# EAGLE design nRF24L01 Shield (EAGLE 7.2.0)
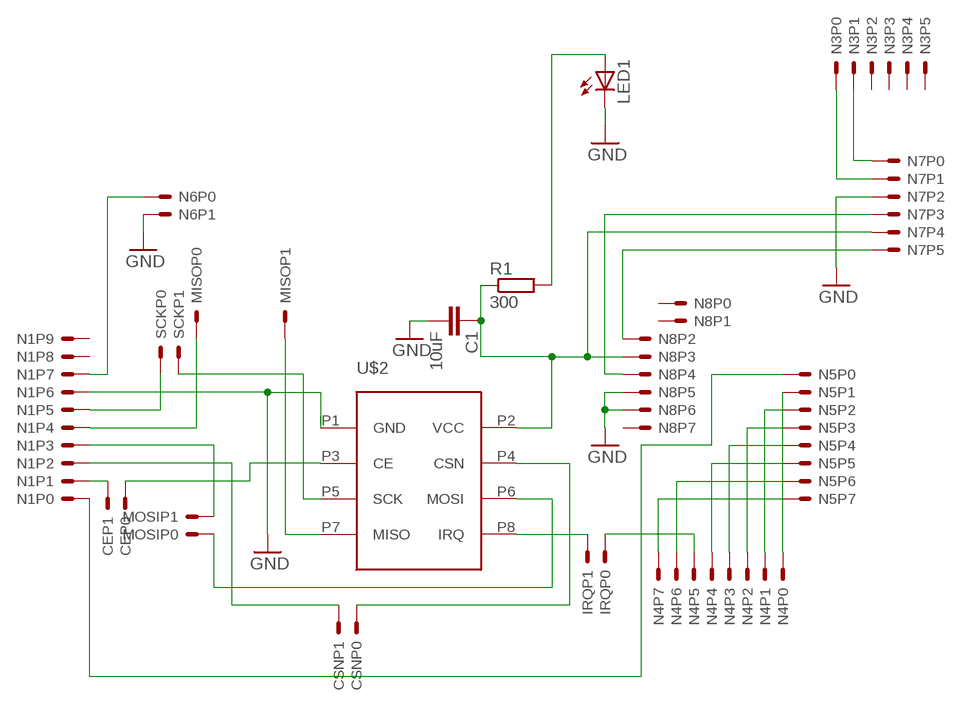
[diagram p0: schematic, sheet 1]

## Parts
C1  10uF  C2.5/4  [C2.5-4]
CE  2PINHEADER  [2PINHEADER]
CSN  2PINHEADER  [2PINHEADER]
IRQ  2PINHEADER  [2PINHEADER]
LED1  LED3MM  [LED3MM]
MISO  2PINHEADER  [2PINHEADER]
MOSI  2PINHEADER  [2PINHEADER]
N1  10PINHEADER  [10PINHEADER]
N3  6PINHEADER  [6PINHEADER]
N4  8PINHEADER  [8PINHEADER]
N5  8PINHEADER  [8PINHEADER]
N6  2PINHEADER  [2PINHEADER]
N7  6PINHEADER  [6PINHEADER]
N8  8PINHEADER  [8PINHEADER]
R1  300  R-EU_0207/10  [0207/10]
SCK  2PINHEADER  [2PINHEADER]
U$2  NRF24L01A  [NRF24L01]

## Nets
GND: C1.2 LED1.K(C) N1.P6 N6.P1 N7.P2 N8.P5 N8.P6 U$2.P1(GND)
N$1: CE.P0 U$2.P3(CE)
N$2: CSN.P0 U$2.P4(CSN)
N$3: MOSI.P0 U$2.P6(MOSI)
N$4: MISO.P1 U$2.P7(MISO)
N$5: SCK.P1 U$2.P5(SCK)
N$6: C1.1 N7.P4 N8.P3 R1.1 U$2.P2(VCC)
N$7: N1.P5 SCK.P0
N$8: IRQ.P0 N4.P5
N$9: LED1.A R1.2
N$10: MISO.P0 N1.P4
N$11: MOSI.P1 N1.P3
N$12: CSN.P1 N1.P2
N$13: CE.P1 N1.P1
N$14: IRQ.P1 U$2.P8(IRQ)
N$15: N4.P7 N5.P7
N$16: N4.P6 N5.P6
N$17: N4.P4 N5.P5
N$18: N4.P3 N5.P4
N$19: N4.P2 N5.P3
N$20: N4.P1 N5.P2
N$21: N4.P0 N5.P1
N$22: N1.P0 N5.P0
N$23: N1.P7 N6.P0
N$25: N7.P5 N8.P2
N$26: N3.P0 N7.P1
N$27: N3.P1 N7.P0
N$31: N7.P3 N8.P4
Unconnected: N1.P8 N1.P9 N3.P2 N3.P3 N3.P4 N3.P5 N8.P0 N8.P1 N8.P7

## Library data of the parts
C1 = capacitor-wima:C: CAPACITOR naming: grid - package width
CE CSN IRQ MISO MOSI N6 SCK = nRF24L01_plus:2PINHEADER
LED1 = adafruit:LED: LED OSRAM: - CHIPLED LG R971, LG N971, LY N971, LG Q971, LY Q971, LO R971, LY R971 LH N974, LH R974 LS Q976, LO Q976, LY Q976 LO Q996 - Hyper CHIPLED LW Q18S LB Q993, LB Q99A, LB R99A - SideLED LS A670, LO A670, LY A670, LG A670, LP A670 LB A673, LV A673, LT A673, LW A673 LH A674 LY A675 LS A676, LA A676, LO A676, LY A676, LW A676 LS A679, LY A679, LG A679 - Hyper Micro SIDELED® LS Y876, LA Y876, LO Y876, LY Y876 LT Y87S - SmartLED LW L88C, LW L88S LB L89C, LB L89S, LG L890 LS L89K, LO L89K, LY L89K LS L896, LA L896, LO L896, LY L896 - TOPLED LS T670, LO T670, LY T670, LG T670, LP T670 LSG T670, LSP T670, LSY T670, LOP T670, LYG T670 LG T671, LOG T671, LSG T671 LB T673, LV T673, LT T673, LW T673 LH T674 LS T676, LA T676, LO T676, LY T676, LB T676, LH T676, LSB T676, LW T676 LB T67C, LV T67C, LT T67C, LS T67K, LO T67K, LY T67K, LW E67C LS E67B, LA E67B, LO E67B, LY E67B, LB E67C, LV E67C, LT E67C LW T67C LS T679, LY T679, LG T679 LS T770, LO T770, LY T770, LG T770, LP T770 LB T773, LV T773, LT T773, LW T773 LH T774 LS E675, LA E675, LY E675, LS T675 LS T776, LA T776, LO T776, LY T776, LB T776 LHGB T686 LT T68C, LB T68C - Hyper Mini TOPLED® LB M676 - Mini TOPLED Santana® LG M470 LS M47K, LO M47K, LY M47K Source: http://www.osram.convergy.de/
N1 = nRF24L01_plus:10PINHEADER
N3 N7 = nRF24L01_plus:6PINHEADER
N4 N5 = nRF24L01_plus:8PINHEADER
N8 = ForceTronics:8PINHEADER
R1 = resistor:R-EU_: RESISTOR, European symbol
U$2 = ForceTronics:NRF24L01

## Board
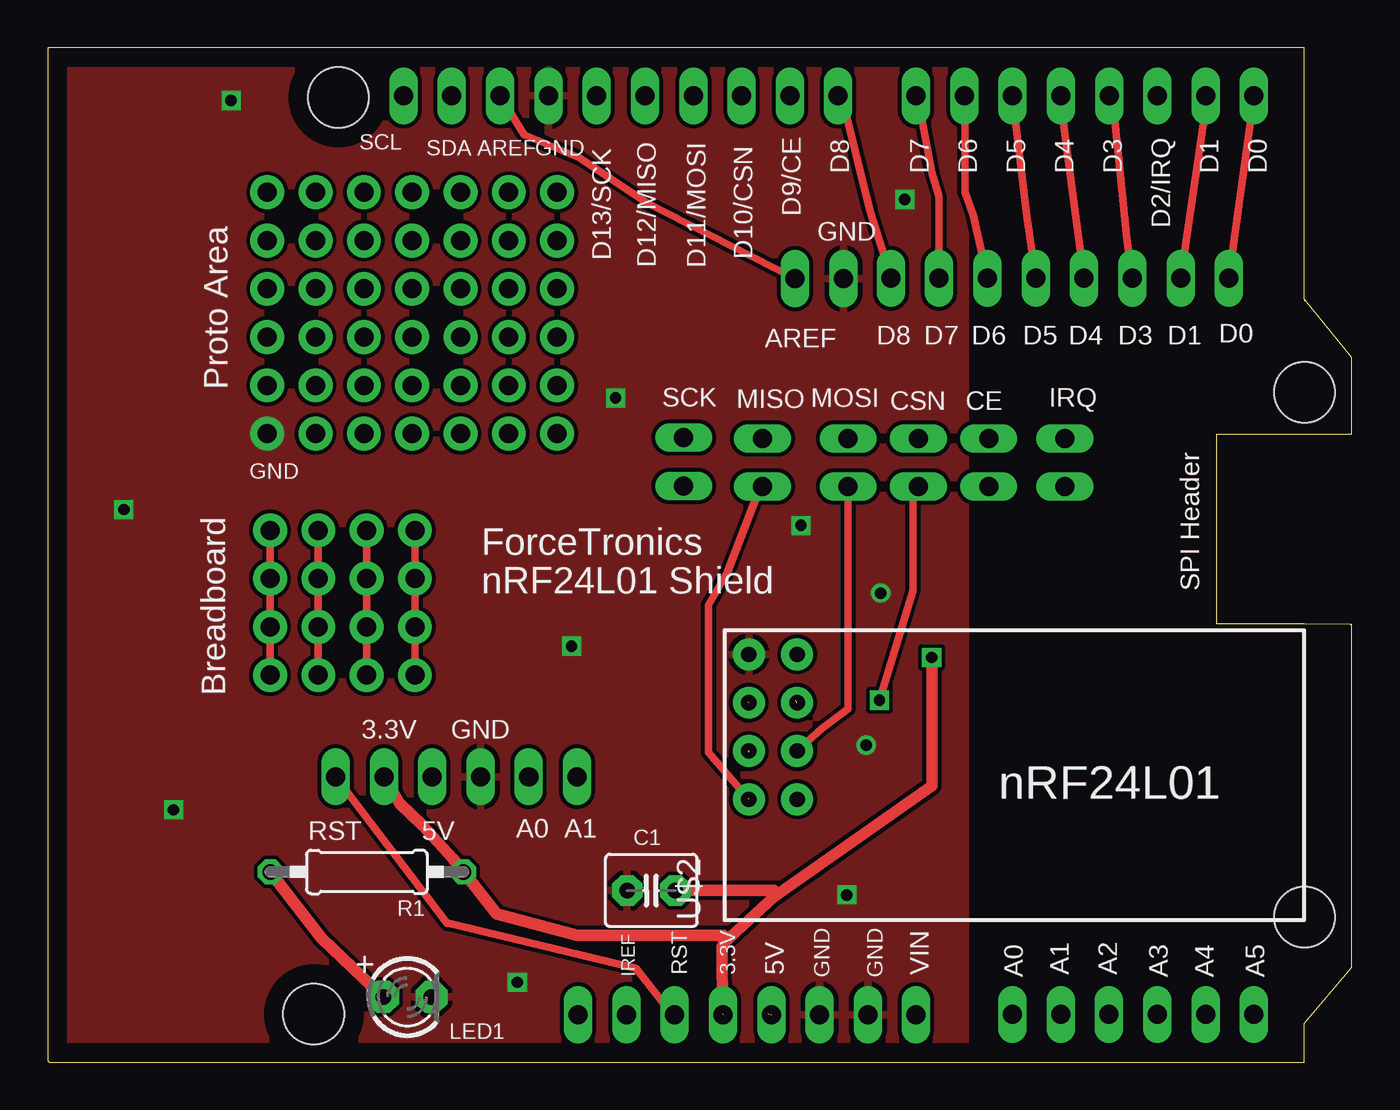
[diagram p1: board, top side]
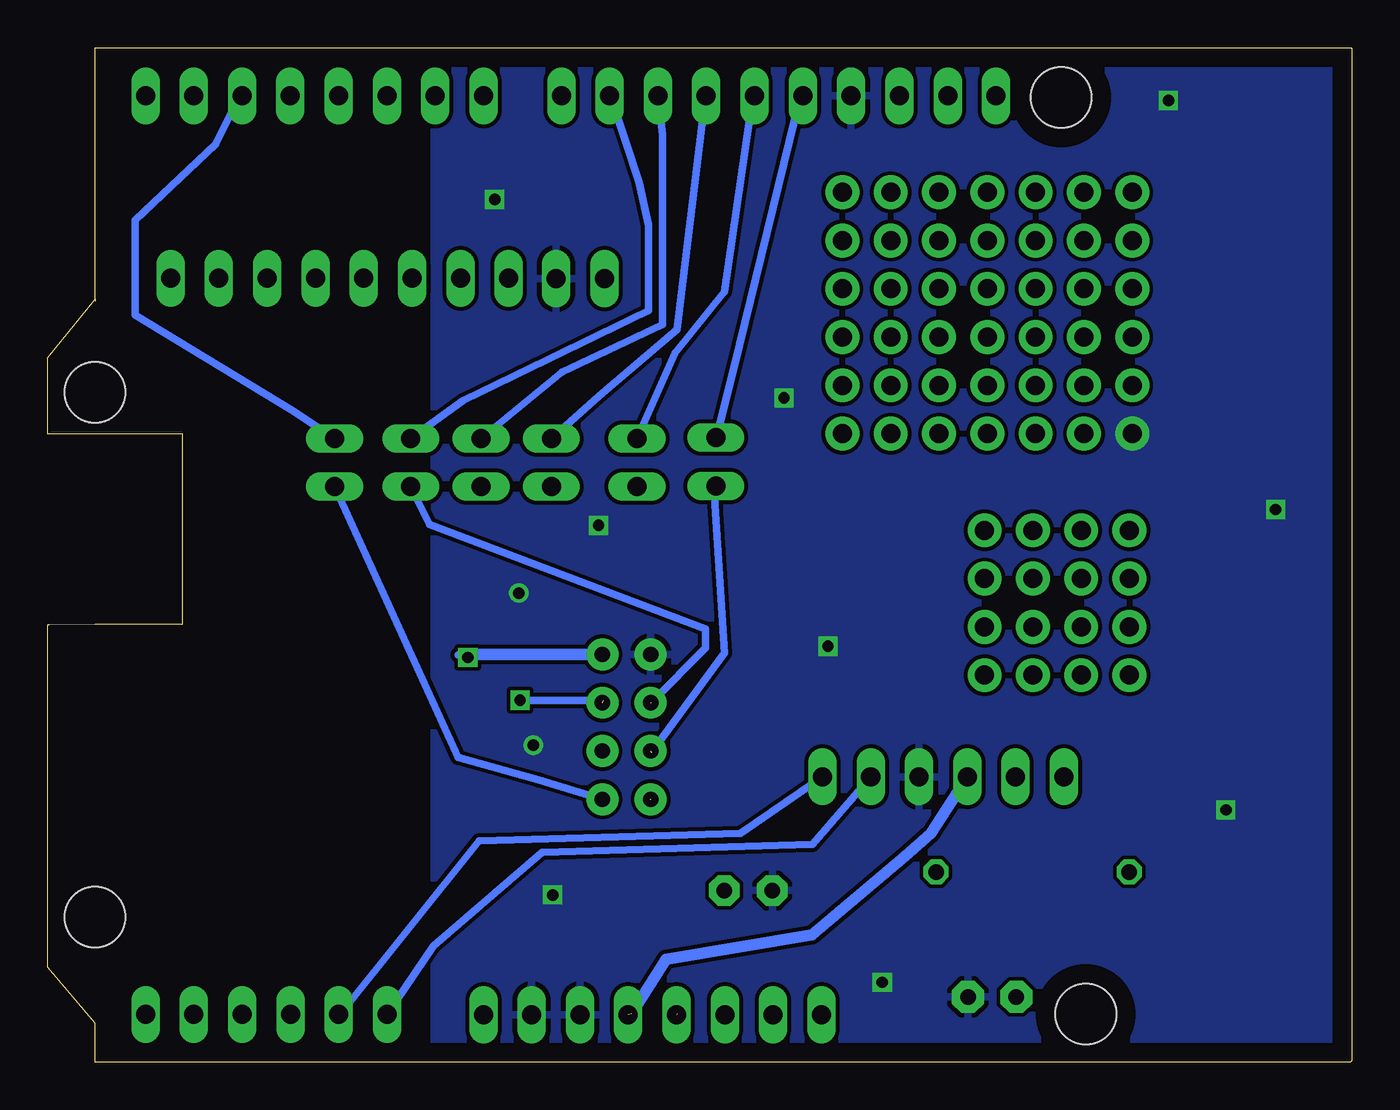
[diagram p2: board, bottom side, seen from below]

Size 68.6 x 53.38 mm. Coordinates in mm from the lower left corner, seen from the top.
Outline: 66.1,40.15 68.6,37.08 68.6,33.1 arc-90 68.55,33.05 61.5,33.05 61.5,23.05 66.1,23.05 68.5,23.05 arc-90 68.6,22.95 68.6,5 66.1,2.05 66.1,0 0.16,0 arc-90 0,0.16 0,53.28 arc-90 0.1,53.38 66.1,53.38 66.1,40.15
Outline: 66.1,40.15 66.1,40.05
Copper layers (1*16): Top 0.035mm / dielectric 1.5mm / Bottom 0.035mm
Design rules "default": minimum track width 10mil, minimum drill 24mil, track to track 8mil, track to pad 8mil, pad to pad 8mil, via to via 8mil, smd to smd 8mil, copper to edge 40mil, drill to drill 8mil, minimum pad ring 10mil, minimum via ring 8mil, stop-mask expansion 4mil, vias tented up to drill 0mil, thermal gap 10mil
Holes 3.2 mm at 14,2.55 15.3,50.75 66.1,7.65 66.11,35.24

### Footprints (pad centres in the part's own frame; a part is rotated, then mirrored left to right if it is on the bottom)
C2.5-4 = drill 0.813 pad 1.6 octagon: 1 -1.27,0; 2 1.27,0
2PINHEADER = drill 1 long: P0 -1.27,0; P1 1.27,0
LED3MM = drill 0.813 pad 1.676 octagon: A -1.27,0; K 1.27,0
10PINHEADER = drill 1 long: P0 1.27,-3.81; P1 3.81,-3.81; P2 6.35,-3.81; P3 8.89,-3.81; P4 11.43,-3.81; P5 13.97,-3.81; P6 16.51,-3.81; P7 19.05,-3.81; P8 21.59,-3.81; P9 24.13,-3.81
6PINHEADER = drill 1 long: P0 1.27,-1.778; P1 3.81,-1.778; P2 6.35,-1.778; P3 8.89,-1.778; P4 11.43,-1.778; P5 13.97,-1.778
8PINHEADER = drill 1 long: P0 1.27,-3.81; P1 3.81,-3.81; P2 6.35,-3.81; P3 8.89,-3.81; P4 11.43,-3.81; P5 13.97,-3.81; P6 16.51,-3.81; P7 19.05,-3.81
0207/10 = drill 0.813 octagon: 1 -5.08,0; 2 5.08,0
NRF24L01 = drill 0.8 pad 1.676: P1 13.97,-1.27; P2 13.97,-3.81; P3 11.43,-1.27; P4 11.43,-3.81; P5 8.89,-1.27; P6 8.89,-3.81; P7 6.35,-1.27; P8 6.35,-3.81

### Placement (x,y rotation side)
C1  31.75,9.05 180 top
CE  49.5,31.55 90 top
CSN  45.8,31.55 90 top
IRQ  53.5,31.55 270 top
LED1  18.92,3.45 0 top
MISO  37.6,31.55 270 top
MOSI  42.1,31.55 90 top
N1  42.85,47.02 180 top
N3  49.48,4.3 0 top
N4  44.4,54.65 0 top
N5  43.08,45.05 0 top
N6  40.58,41.23 0 top
N7  29.12,13.25 180 top
N8  26.63,6.32 0 top
R1  16.8,10.02 180 top
SCK  33.45,31.59 270 top
U$2  35.61,7.49 90 top

### Tracks (layer width: path | path; a pad name or v marks a point on that pad's centre or on a via)
GND  (via drill 0.6, 0.6 pad 0.81, 1 pad 1.78)
  other vias: 6.63,13.28 24.71,4.22 42.04,8.81 43.81,24.69 43.05,16.69 27.56,21.89 39.62,28.24 29.87,34.95 45.09,45.39 9.65,50.6 11.56,33.07 4.01,29.08
  pour Top: -2.54,55.93 -2.54,-2.49 48.26,-2.49 48.26,55.93
  pour Bottom: -2.54,55.93 48.26,55.93 48.26,-2.49 -2.54,-2.49
N$1  (1 unrouted)
  Bottom 0.406: CE.P0 48.5,28.3 34,22.8 34,21.8 36.83,18.95
N$2  (via drill 0.6)  (1 unrouted)
  Top 0.406: CSN.P0 45.5,30.28 45.5,24.8 v43.75,19.05
  Bottom 0.406: v43.75,19.05 39.37,19.05
N$3
  Top 0.406: MOSI.P0 42.1,18.59 40.72,17.58 U$2.P6
N$4  (1 unrouted)
  Top 0.406: MISO.P1 37.5,30.28 35.75,25.8 34.75,24.05 34.75,16.3 36.85,13.85
N$5  (1 unrouted)
  Bottom 0.406: SCK.P1 33.5,29.32 33,21.55 36.83,16.3
N$6  (via drill 0.6)  (1 unrouted)
  Top 0.406: 35.48,6.09 35.55,6.27 | 38.21,9.05 38.21,8.71
  Top 0.61: 35.5,2.55 35.48,6.09 | v46.5,21.3 46.5,14.55 38.21,8.71 35.55,6.27 35.55,6.68 27.84,6.68 23.62,7.82 R1.1 21.32,10.71 19.73,12.47 18.52,13.63 N7.P4 | C1.1 38.21,9.05
  Bottom 0.406: 47,21.42 v46.5,21.3 46.5,21.46
  Bottom 0.61: U$2.P2 46.5,21.46
N$7
  Bottom 0.406: 33.25,32.86 SCK.P0 33.45,32.8 32.5,36.55 29,50.83 N1.P5
N$8
  Bottom 0.406: N4.P5 58.5,50.84 59.75,48.3 64,44.3 64,39.3 55.75,34.3 IRQ.P0
N$9
  Top 0.61: LED1.A 14.41,6.52 R1.2
N$10
  Bottom 0.406: N1.P4 31.5,50.83 33,40.55 35.6,37.3 MISO.P0
N$11
  Bottom 0.406: N1.P3 34,50.83 35.5,38.55 39.6,35.05 MOSI.P1
N$12
  Bottom 0.406: N1.P2 36.25,48.8 36.25,38.8 41.55,36.3 CSN.P1
N$13
  Bottom 0.406: N1.P1 39,50.83 37.5,46.3 37,44.05 37,39.55 46.75,34.8 CE.P1
N$14
  Bottom 0.406: IRQ.P1 47,16.05 42.78,14.86 U$2.P8
N$15
  Top 0.406: N5.P7 63.45,50.74 N4.P7
N$16
  Top 0.406: N4.P6 61,50.84 61,50.8 59.59,41.3 N5.P6
N$17
  Top 0.406: N4.P4 56,50.84 56.75,43.3 57.05,41.3 N5.P5
N$18
  Top 0.406: N4.P3 53.25,50.84 54,45.05 54.51,41.3 N5.P4
N$19
  Top 0.406: N5.P3 51.5,44.49 N4.P2
N$20
  Top 0.406: N4.P1 48.25,50.84 48.25,45.8 48.68,44.55 N5.P2
N$21
  Top 0.406: N4.P0 45.75,50.84 46.5,46.8 46.89,45.55 N5.P1
N$22
  Top 0.406: N1.P0 41.75,50.83 43.25,44.8 44.35,41.3 N5.P0
N$23
  Top 0.406: 23.7,50.83 N1.P7 25.05,48.8 28,47.55 31.5,45.23 N6.P0
N$25
  Top 0.406: N7.P5 21.01,7.33 21.01,7.34 30.94,4.95 32.87,2.51 N8.P2
N$26
  Bottom 0.406: N3.P0 48.3,6.12 42.6,11.05 28.37,11.48 N7.P1
N$27
  Bottom 0.406: N3.P1 53.2,2.52 45.9,11.65 32.15,12.05 N7.P0
N$28  (via drill 1 pad 1.78)
  other vias: 11.56,45.77
N$29  (via drill 1 pad 1.78)
  other vias: 14.1,45.77
N$30  (via drill 1 pad 1.78)
  other vias: 16.64,45.77
N$31  (1 unrouted)
  Bottom 0.61: 37.9,2.55 36.07,5.43 28.4,6.72 23.5,10.85 22.13,12.05 N7.P3
N$32  (via drill 1 pad 1.78)
  other vias: 19.18,45.77
N$33  (via drill 1 pad 1.78)
  other vias: 21.72,45.77
N$34  (via drill 1 pad 1.78)
  other vias: 24.26,45.77
N$35  (via drill 1 pad 1.78)
  other vias: 26.8,45.77
N$36  (via drill 1 pad 1.78)
  other vias: 11.56,43.23
N$37  (via drill 1 pad 1.78)
  other vias: 14.1,43.23
N$38  (via drill 1 pad 1.78)
  other vias: 16.64,43.23
N$39  (via drill 1 pad 1.78)
  other vias: 19.18,43.23
N$40  (via drill 1 pad 1.78)
  other vias: 21.72,43.23
N$41  (via drill 1 pad 1.78)
  other vias: 24.26,43.23
N$42  (via drill 1 pad 1.78)
  other vias: 26.8,43.23
N$43  (via drill 1 pad 1.78)
  other vias: 11.56,40.69
N$45  (via drill 1 pad 1.78)
  other vias: 14.1,40.69
N$46  (via drill 1 pad 1.78)
  other vias: 16.64,40.69
N$47  (via drill 1 pad 1.78)
  other vias: 19.18,40.69
N$48  (via drill 1 pad 1.78)
  other vias: 21.72,40.69
N$49  (via drill 1 pad 1.78)
  other vias: 24.26,40.69
N$50  (via drill 1 pad 1.78)
  other vias: 26.8,40.69
N$51  (via drill 1 pad 1.78)
  other vias: 26.8,38.15
N$52  (via drill 1 pad 1.78)
  other vias: 24.26,38.15
N$53  (via drill 1 pad 1.78)
  other vias: 21.72,38.15
N$54  (via drill 1 pad 1.78)
  other vias: 19.18,38.15
N$55  (via drill 1 pad 1.78)
  other vias: 16.64,38.15
N$56  (via drill 1 pad 1.78)
  other vias: 14.1,38.15
N$57  (via drill 1 pad 1.78)
  other vias: 11.56,38.15
N$58  (via drill 1 pad 1.78)
  other vias: 11.56,35.61
N$59  (via drill 1 pad 1.78)
  other vias: 14.1,35.61
N$60  (via drill 1 pad 1.78)
  other vias: 16.64,35.61
N$61  (via drill 1 pad 1.78)
  other vias: 19.18,35.61
N$62  (via drill 1 pad 1.78)
  other vias: 21.72,35.61
N$63  (via drill 1 pad 1.78)
  other vias: 24.26,35.61
N$64  (via drill 1 pad 1.78)
  other vias: 26.8,35.61
N$65  (via drill 1 pad 1.78)
  other vias: 26.8,33.07
N$66  (via drill 1 pad 1.78)
  other vias: 24.26,33.07
N$67  (via drill 1 pad 1.78)
  other vias: 21.72,33.07
N$68  (via drill 1 pad 1.78)
  other vias: 19.18,33.07
N$69  (via drill 1 pad 1.78)
  other vias: 16.64,33.07
N$70  (via drill 1 pad 1.78)
  other vias: 14.1,33.07
N$74  (via drill 1 pad 1.78)
  Top 0.406: v11.7,27.99 v11.7,25.45 v11.7,22.91 v11.7,20.37
N$75  (via drill 1 pad 1.78)
  Top 0.406: v14.24,27.99 v14.24,25.45 v14.24,22.91 v14.24,20.37
N$76  (via drill 1 pad 1.78)
  Top 0.406: v16.78,27.99 v16.78,25.45 v16.78,22.91 v16.78,20.37
N$93  (via drill 1 pad 1.78)
  Top 0.406: v19.32,27.99 v19.32,25.45 v19.32,22.91 v19.32,20.37

### Text on the board
tPlace: ForceTronics | nRF24L01 Shield
tNames: SCL | SDA | AREF | GND | D8 | D7 | D6 | D5 | D4 | D3 | D1 | D0 | D9/CE | D2/IRQ | GND | D13/SCK | D12/MISO | D11/MOSI | D10/CSN | AREF | D8 | D7 | D6 | D5 | D4 | D3 | D1 | D0 | Proto Area | GND | Breadboard | SPI Header | 3.3V | GND | nRF24L01 | RST | 5V | A0 | A1 | RST | 3.3V | 5V | VIN | A1 | A2 | IREF | GND | GND | A0 | A3 | A4 | A5